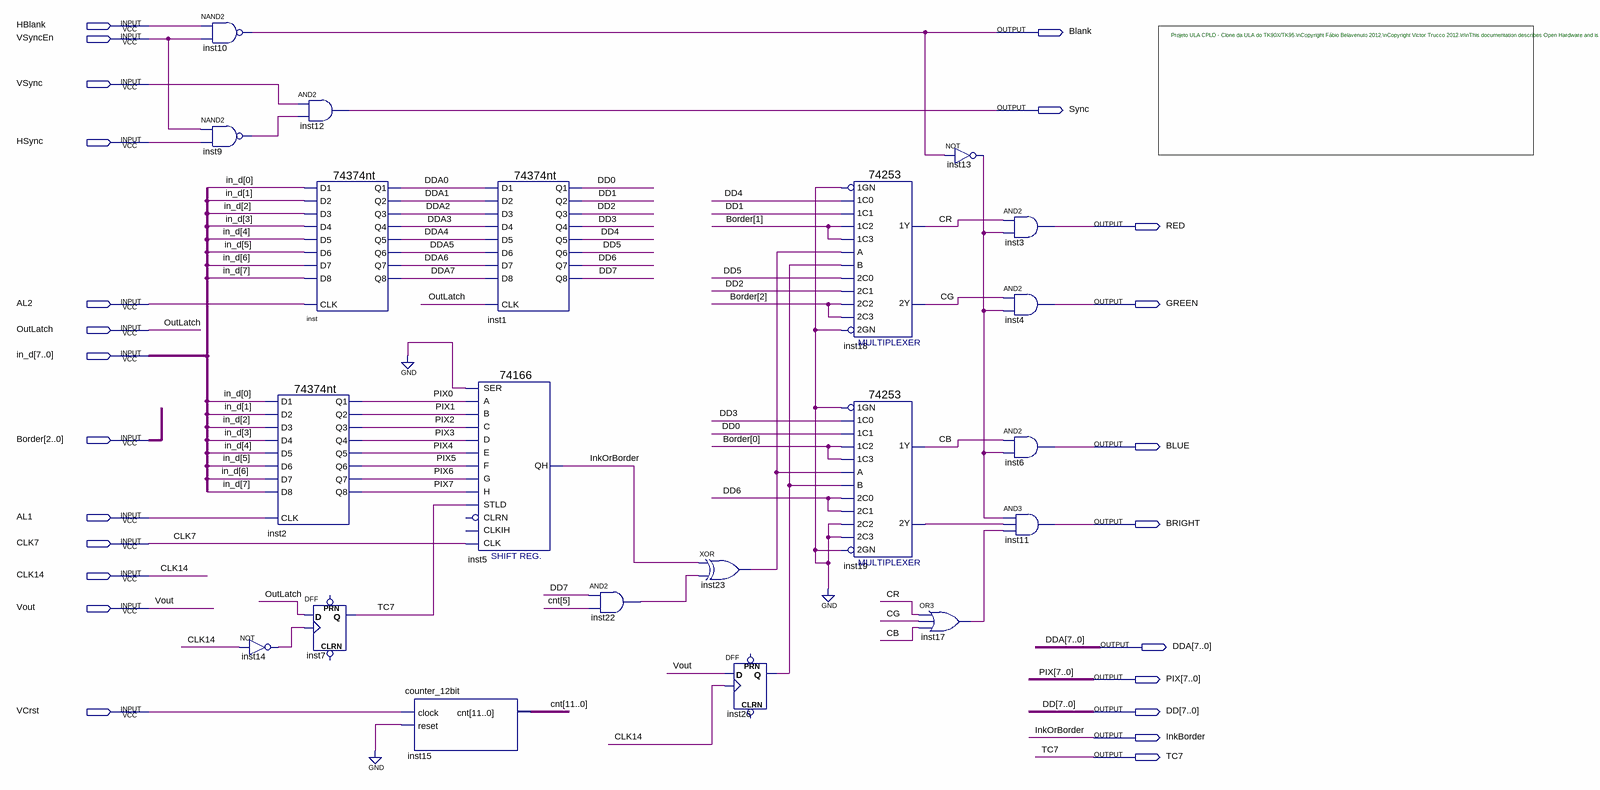
[diagram p0: schematic sheet]
// Quartus schematic Display.bdf as structural Verilog: 21 symbols, 24 pins
module Display (
  input  HBlank,
  input  VSyncEn,
  input  VSync,
  input  HSync,
  input  AL2,
  input  OutLatch,
  input  [7:0] in_d,
  input  [2:0] Border,
  input  AL1,
  input  CLK7,
  input  CLK14,
  input  Vout,
  input  VCrst,
  output Blank,
  output Sync,
  output RED,
  output GREEN,
  output BLUE,
  output BRIGHT,
  output [7:0] DDA,
  output [7:0] PIX,
  output [7:0] DD,
  output InkBorder,
  output TC7
);

  wire CB, CG, CR, inst9_out, inst13_out, inst14_out, inst17_out, inst19_2y, inst22_out, inst23_out, inst26_q;
  wire [11:0] cnt;

  nand inst10 (Blank, HBlank, VSyncEn);
  nand inst9 (inst9_out, VSyncEn, HSync);
  not inst14 (inst14_out, CLK14);
  and inst12 (Sync, VSync, inst9_out);
  \74374nt  inst (
    .D3(in_d[2]), .D2(in_d[1]), .D1(in_d[0]), .D7(in_d[6]), .D6(in_d[5]), .D4(in_d[3]), .D5(in_d[4]),
    .D8(in_d[7]), .CLK(AL2), .Q8(DDA[7]), .Q7(DDA[6]), .Q6(DDA[5]), .Q3(DDA[2]), .Q4(DDA[3]), .Q5(DDA[4]),
    .Q1(DDA[0]), .Q2(DDA[1]));
  \74374nt  inst2 (
    .D3(in_d[2]), .D2(in_d[1]), .D1(in_d[0]), .D7(in_d[6]), .D6(in_d[5]), .D4(in_d[3]), .D5(in_d[4]),
    .D8(in_d[7]), .CLK(AL1), .Q8(PIX[7]), .Q7(PIX[6]), .Q6(PIX[5]), .Q3(PIX[2]), .Q4(PIX[3]), .Q5(PIX[4]),
    .Q1(PIX[0]), .Q2(PIX[1]));
  DFF inst7 (.CLK(inst14_out), .D(OutLatch), .Q(TC7));  // open: CLRN, PRN
  counter_12bit inst15 (.clock(VCrst), .reset(1'b0), .cnt(cnt));
  \74374nt  inst1 (
    .D3(DDA[2]), .D2(DDA[1]), .D1(DDA[0]), .D7(DDA[6]), .D6(DDA[5]), .D4(DDA[3]), .D5(DDA[4]), .D8(DDA[7]),
    .CLK(OutLatch), .Q8(DD[7]), .Q7(DD[6]), .Q6(DD[5]), .Q3(DD[2]), .Q4(DD[3]), .Q5(DD[4]), .Q1(DD[0]),
    .Q2(DD[1]));
  \74166  inst5 (
    .SER(1'b0), .A(PIX[0]), .C(PIX[2]), .D(PIX[3]), .E(PIX[4]), .B(PIX[1]), .STLD(TC7), .H(PIX[7]),
    .G(PIX[6]), .F(PIX[5]), .CLK(CLK7), .QH(InkBorder));  // open: CLRN, CLKIH
  and inst22 (inst22_out, DD[7], cnt[5]);
  xor inst23 (inst23_out, InkBorder, inst22_out);
  DFF inst26 (.CLK(CLK14), .D(Vout), .Q(inst26_q));  // open: CLRN, PRN
  \74253  inst18 (
    .\1GN (1'b0), .\1C3 (Border[1]), .\1C2 (Border[1]), .\2C2 (Border[2]), .\2C3 (Border[2]), .\1C1 (DD[1]),
    .\1C0 (DD[4]), .\2C1 (DD[2]), .\2C0 (DD[5]), .B(inst26_q), .A(inst23_out), .\2GN (1'b0), .\2Y (CG),
    .\1Y (CR));
  \74253  inst19 (
    .\1GN (1'b0), .\1C3 (Border[0]), .\1C2 (Border[0]), .\2C2 (1'b0), .\2C3 (1'b0), .\1C1 (DD[0]),
    .\1C0 (DD[3]), .\2C1 (DD[6]), .\2C0 (DD[6]), .B(inst26_q), .A(inst23_out), .\2GN (1'b0),
    .\2Y (inst19_2y), .\1Y (CB));
  or inst17 (inst17_out, CR, CG, CB);
  not inst13 (inst13_out, Blank);
  and inst3 (RED, CR, inst13_out);
  and inst4 (GREEN, CG, inst13_out);
  and inst6 (BLUE, CB, inst13_out);
  and inst11 (BRIGHT, inst13_out, inst19_2y, inst17_out);

  // Other names for the same wires on the sheet: InkOrBorder = InkBorder

  // Notes on the sheet:
  //   Projeto ULA CPLD - Clone da ULA do TK90X/TK95.\nCopyright Fábio Belavenuto 2012.\nCopyright Victor Trucco 2012.\n\nThis documentation describes Open Hardware and is licensed under the CERN OHL v. 1.1.\nYou may redistribute and modify this documentation under the terms of the\nCERN OHL v.1.1. (http://ohwr.org/cernohl). This documentation is distributed\nWITHOUT ANY EXPRESS OR IMPLIED WARRANTY, INCLUDING OF MERCHANTABILITY,\nSATISFACTORY QUALITY AND FITNESS FOR A PARTICULAR PURPOSE.\nPlease see the CERN OHL v.1.1 for applicable conditions
endmodule
